# Altium schematic sheet SDCard.SchDoc: Dahlia Carrier Board
size A3; Organization: Toradex AG; Address1: Ebenaustrasse 10; Address2: Horw; Address3: 6048; Address4: Switzerland; DocumentNumber: 14; Revision: V1.1; SheetNumber: 14; SheetTotal: 21; PageSetup: Record=PageOptions|CenterHorizontal=True|CenterVertical=True|PrintScale=0.71|XCorrection=1.00|YCorrection=1.00|PrintKind=1|BorderSize=5000000|LeftOffset=0|BottomOffset=0|Orientation=2|PaperLength=1000|PaperWidth=1000|Scale=100|PaperSource=15|PrintQuality=600|MediaType=1|DitherType=10|PaperKind=A4|PrintScaleMode=1
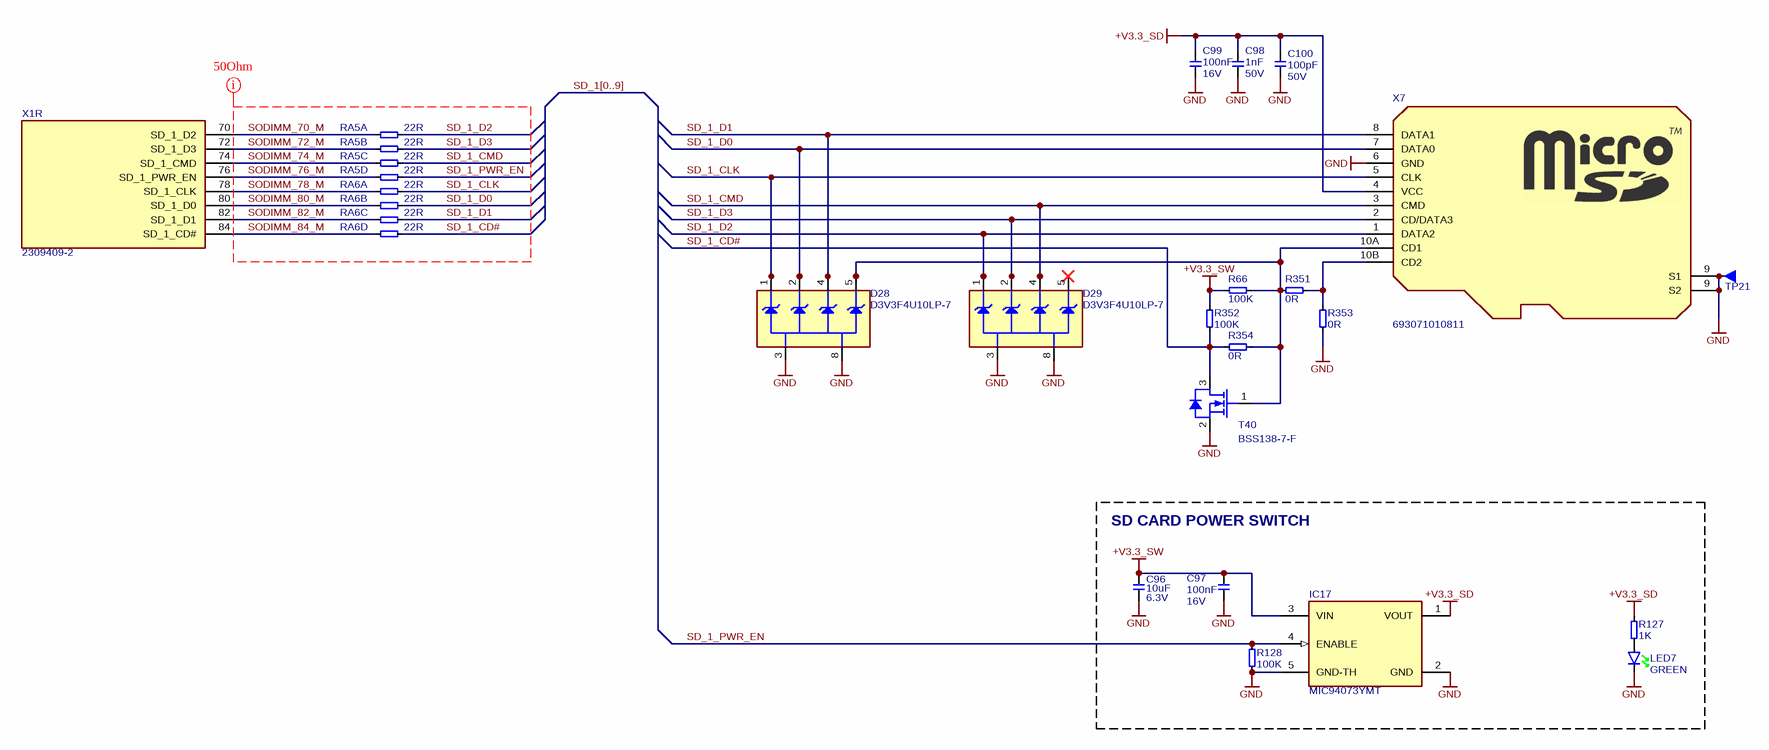
[diagram p0: SDCard.SchDoc]

## Parts
C96  Rating: 6.3V  [CAPC1005X60N]  (hidden comment: 10uF)
C97  Rating: 16V  [CAPC1005X60N]  (hidden comment: 100nF)
C98  Rating: 50V  [CAPC1005X60N]  (hidden comment: 1nF)
C99  Rating: 16V  [CAPC1005X60N]  (hidden comment: 100nF)
C100  Rating: 50V  [CAPC1005X60N]  (hidden comment: 100pF)
D28  D3V3F4U10LP-7  [D-Diodes-D3V3F4U10LP-7]
D29  D3V3F4U10LP-7  [D-Diodes-D3V3F4U10LP-7]
IC17  MIC94073YMT  [T_TDFN0P120X160X60-4N]
LED7  Color: GREEN  [T_Liteon_LTST-C190GKT]  (hidden comment: LTST-C190GKT)
R66  100K  [RESC1005X40N]
R127  1K  [RESC1005X40N]
R128  100K  [RESC1005X40N]
R351  0R  [T_RESC0603X30N]
R352  100K  [RESC1005X40N]
R353  0R  [T_RESC0603X30N]
R354  0R  [T_RESC0603X30N]
RA5  22R  [T_Resistor_Array_X4]  (parts A,B,C,D of 4)
RA6  22R  [T_Resistor_Array_X4]  (parts A,B,C,D of 4)
T40  BSS138-7-F  [SOT95P237X112-3N]
TP21  Testpin-THT  [T_TP-THT]  (value not drawn)  (no BOM)
X1  2309409-2  [CON-TE-2309409-2-SOLDERABLE-STANDOFFS]  (part R of 23)
X7  Manufacturer Part No.: 693071010811  [T_Wurth_693071010811]  (hidden comment: MicroSD Holder)

## Blocks framed on the sheet
SD CARD POWER SWITCH: C96 C97 IC17 LED7 R127 R128

## Nets
+V3.3_SD: C98.2 C99.2 C100.2 IC17.1(VOUT) R127.2 X7.4(VCC)
+V3.3_SW: C96.2 C97.2 IC17.3(VIN) R66.2 R352.1
GND: C96.1 C97.1 C98.1 C99.1 C100.1 D28.3 D28.8 D29.3 D29.8 IC17.2(GND) IC17.5(GND-TH) LED7.K R128.1 R353.1 T40.2(S) TP21.1 X7.6(GND) X7.9(S1)
SD_1_CD#: R352.2 R354.2 RA6.8 T40.3(D)
SD_1_CLK: D28.1 D28.10 RA6.5 X7.5(CLK)
SD_1_CMD: D29.4 D29.7 RA5.7 X7.3(CMD)
SD_1_D0: D28.2 D28.9 RA6.6 X7.7(DATA0)
SD_1_D1: D28.4 D28.7 RA6.7 X7.8(DATA1)
SD_1_D2: D29.1 D29.10 RA5.5 X7.1(DATA2)
SD_1_D3: D29.2 D29.9 RA5.6 X7.2(CD/DATA3)
SD_1_PWR_EN: IC17.4(ENABLE) R128.2 RA5.8
SODIMM_70_M: RA5.1 X1.70(SD_1_D2)
SODIMM_72_M: RA5.2 X1.72(SD_1_D3)
SODIMM_74_M: RA5.3 X1.74(SD_1_CMD)
SODIMM_76_M: RA5.4 X1.76(SD_1_PWR_EN)
SODIMM_78_M: RA6.1 X1.78(SD_1_CLK)
SODIMM_80_M: RA6.2 X1.80(SD_1_D0)
SODIMM_82_M: RA6.3 X1.82(SD_1_D1)
SODIMM_84_M: RA6.4 X1.84(SD_1_CD#)
NetD28_5: D28.5 D28.6 R66.1 R351.2 R354.1 T40.1(G) X7.10A(CD1)
NetD29_5: D29.5 D29.6
NetLED7_A: LED7.A R127.1
NetR351_1: R351.1 R353.2 X7.10B(CD2)

## Buses and harness runs
bus SD_1[0..9]

## Layout directives
net class 50Ohm: SD_1_CD#, SD_1_CLK, SD_1_CMD, SD_1_D0, SD_1_D1, SD_1_D2, SD_1_D3, SD_1_PWR_EN, SODIMM_70_M, SODIMM_72_M, SODIMM_74_M, SODIMM_76_M, SODIMM_78_M, SODIMM_80_M, SODIMM_82_M, SODIMM_84_M

## Notes on the sheet
- Title
- Size:
- Date:
- A3
- Number:
- Time:
- Revision:
- Sheet
- of
- File:

## Library data of the parts
C96 = C-X5R-10u-6.3V-20%-0402: Capacitor Ceramic X5R 10uF 6.3V 20% 0402; Tolerance: 20%; Type: X5R; Value: 10uF
C97 C99 = C-X7R-100nF-16V-10%-0402: Capacitor Ceramic X7R 100nF 16V 10% 0402; Tolerance: 10%; Type: X7R; Value: 100nF
C98 = C-X7R-1nF-50V-10%-0402: Capacitor Ceramic X7R 1nF 50V 10% 0402; Tolerance: 10%; Type: X7R; Value: 1nF
C100 = C-X7R-100pF-50V-10%-0402: Capacitor Ceramic X7R 100pF 50V 10% 0402; Tolerance: 10%; Type: X7R; Value: 100pF
D28 D29 = D-Diodes-D3V3F4U10LP-7: 4 CHANNEL LOW CAPACITANCE TVS DIODE ARRAY; Manufacturer Name: Nexperia; Manufacturer Part No.: D3V3F4U10LP-7
IC17 = IC-Microchip-MIC94073YMT: High Side Load Switch, TDFN4 1.2 x 1.6; Manufacturer Name: Microchip; Package: TDFN-4; Manufacturer Part No.: MIC94073YMT
LED7 = LED-LiteOn-LTST-C190GKT: LED green Lite-ON LTST-C190GKT; Manufacturer Name: Lite-ON; Manufacturer Part No.: LTST-C190GKT
R66 R128 R352 = R-100K-63mW-5%-0402: Resistor 100 Kohm 63mW 5% 0402; Rating: 63mW; Tolerance: 5%; Value: 100K
R127 = R-1K-63mW-5%-0402: Resistor 1 Kohm 63mW 5% 0402; Rating: 63mW; Tolerance: 5%; Value: 1K
R351 R353 R354 = R-0R-63mW-1%-0603: Resistor 0 ohm 63mW 1% 0603; Rating: 63mW; Tolerance: 1%; Value: 0R
RA5 RA6 = RA-22R-63mW-5%-1206-div: Resistor Array 22 R 63mW 5% 1206; Tolerance: 5%; Power Dissipation: 63mW; Value: 22R
T40 = T-Diodes-BSS138-7-F: N-channel MOSFET, BSS138-7-F; Manufacturer Name: Diodes; Manufacturer Part No.: BSS138-7-F
TP21 = Testpin-THT: Testpin THT
X1 = CON-TE-2309409-2: DDR4 SODIMM Socket, 260 pins, 5.2mm(H), 0.5mm Pitch; Manufacturer Name: TE; Temperature Range: -40C to +125C; Package: DDR4-SODIMM-260; Manufacturer Part No.: 2309409-2
X7 = CON-Wurth-693071010811: Micro SD Holder Push Push CD; Manufacturer Name: Wurth; No. of ways: 9